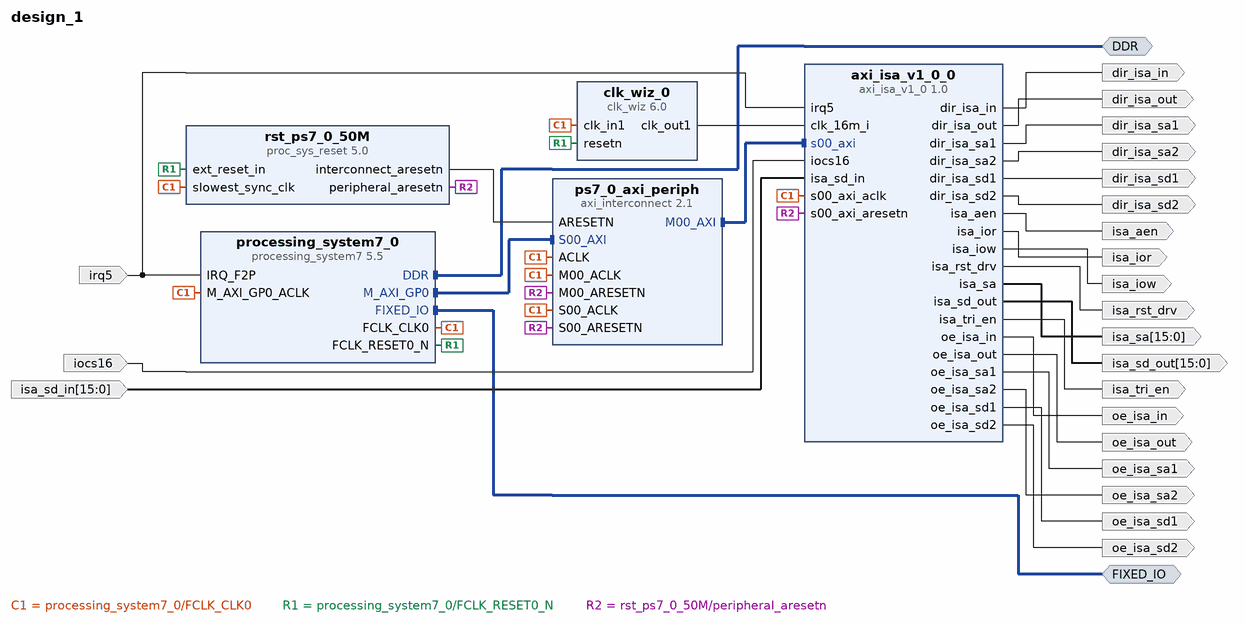
[diagram p0: block diagram of the top level]
# Vivado block design design_1, xc7z010clg400-1, Vivado 2018.2
create_bd_design design_1

create_bd_intf_port -mode Master -vlnv xilinx.com:interface:ddrx_rtl:1.0 DDR
create_bd_intf_port -mode Master -vlnv xilinx.com:display_processing_system7:fixedio_rtl:1.0 FIXED_IO
create_bd_port -dir O isa_tri_en
create_bd_port -dir O -from 15 -to 0 isa_sd_out
create_bd_port -dir O isa_aen
create_bd_port -dir O isa_rst_drv
create_bd_port -dir O isa_ior
create_bd_port -dir O isa_iow
create_bd_port -dir O -from 15 -to 0 isa_sa
create_bd_port -dir O dir_isa_out
create_bd_port -dir O dir_isa_in
create_bd_port -dir O dir_isa_sa2
create_bd_port -dir O dir_isa_sa1
create_bd_port -dir O dir_isa_sd2
create_bd_port -dir O dir_isa_sd1
create_bd_port -dir O oe_isa_out
create_bd_port -dir O oe_isa_in
create_bd_port -dir O oe_isa_sa2
create_bd_port -dir O oe_isa_sa1
create_bd_port -dir O oe_isa_sd2
create_bd_port -dir O oe_isa_sd1
create_bd_port -dir I iocs16
create_bd_port -dir I irq5
create_bd_port -dir I -from 15 -to 0 isa_sd_in

create_bd_cell -type ip -vlnv xilinx.com:ip:processing_system7:5.5 processing_system7_0
set_property -dict [list \
  CONFIG.PCW_SDIO_PERIPHERAL_FREQMHZ 100 \
  CONFIG.PCW_UART_PERIPHERAL_FREQMHZ 100 \
  CONFIG.PCW_USE_FABRIC_INTERRUPT 1 \
  CONFIG.PCW_IRQ_F2P_INTR 1 \
  CONFIG.PCW_PRESET_BANK1_VOLTAGE {LVCMOS 1.8V} \
  CONFIG.PCW_UIPARAM_DDR_PARTNO {MT41J128M16 HA-125} \
  CONFIG.PCW_QSPI_PERIPHERAL_ENABLE 1 \
  CONFIG.PCW_QSPI_QSPI_IO {MIO 1 .. 6} \
  CONFIG.PCW_QSPI_GRP_SINGLE_SS_ENABLE 1 \
  CONFIG.PCW_QSPI_GRP_SINGLE_SS_IO {MIO 1 .. 6} \
  CONFIG.PCW_SINGLE_QSPI_DATA_MODE x4 \
  CONFIG.PCW_ENET0_PERIPHERAL_ENABLE 1 \
  CONFIG.PCW_ENET0_ENET0_IO {MIO 16 .. 27} \
  CONFIG.PCW_ENET0_GRP_MDIO_ENABLE 1 \
  CONFIG.PCW_ENET0_GRP_MDIO_IO {MIO 52 .. 53} \
  CONFIG.PCW_SD0_PERIPHERAL_ENABLE 1 \
  CONFIG.PCW_SD0_SD0_IO {MIO 40 .. 45} \
  CONFIG.PCW_SD0_GRP_CD_ENABLE 1 \
  CONFIG.PCW_SD0_GRP_CD_IO {MIO 47} \
  CONFIG.PCW_SD0_GRP_WP_ENABLE 0 \
  CONFIG.PCW_UART1_PERIPHERAL_ENABLE 1 \
  CONFIG.PCW_UART1_UART1_IO {MIO 48 .. 49} \
] [get_bd_cells processing_system7_0]
# 130 more settings of processing_system7_0 are not shown: defaults, MIO pin electricals, DDR timing, and values the tool derives
create_bd_cell -type ip -vlnv xilinx.com:ip:clk_wiz:6.0 clk_wiz_0
set_property -dict [list \
  CONFIG.PRIM_IN_FREQ 50 \
  CONFIG.CLKIN1_JITTER_PS 200.0 \
  CONFIG.CLKOUT1_REQUESTED_OUT_FREQ 16 \
  CONFIG.USE_LOCKED false \
  CONFIG.RESET_PORT resetn \
  CONFIG.MMCM_DIVCLK_DIVIDE 1 \
  CONFIG.MMCM_CLKFBOUT_MULT_F 20.000 \
  CONFIG.MMCM_CLKIN1_PERIOD 20.000 \
  CONFIG.MMCM_CLKIN2_PERIOD 10.0 \
  CONFIG.MMCM_CLKOUT0_DIVIDE_F 62.500 \
  CONFIG.RESET_TYPE ACTIVE_LOW \
  CONFIG.CLKOUT1_JITTER 260.765 \
  CONFIG.CLKOUT1_PHASE_ERROR 164.985 \
] [get_bd_cells clk_wiz_0]
create_bd_cell -type ip -vlnv xilinx.com:ip:axi_interconnect:2.1 ps7_0_axi_periph
set_property -dict {CONFIG.NUM_MI 1} [get_bd_cells ps7_0_axi_periph]
create_bd_cell -type ip -vlnv xilinx.com:ip:proc_sys_reset:5.0 rst_ps7_0_50M
create_bd_cell -type ip -vlnv xilinx.com:user:axi_isa_v1_0:1.0 axi_isa_v1_0_0

# ---- connections ----

connect_bd_intf_net [get_bd_intf_pins processing_system7_0/M_AXI_GP0] [get_bd_intf_pins ps7_0_axi_periph/S00_AXI]
connect_bd_intf_net [get_bd_intf_pins ps7_0_axi_periph/M00_AXI] [get_bd_intf_pins axi_isa_v1_0_0/s00_axi]
connect_bd_intf_net [get_bd_intf_ports DDR] [get_bd_intf_pins processing_system7_0/DDR]
connect_bd_intf_net [get_bd_intf_ports FIXED_IO] [get_bd_intf_pins processing_system7_0/FIXED_IO]
connect_bd_net [get_bd_pins processing_system7_0/FCLK_CLK0] \
  [get_bd_pins clk_wiz_0/clk_in1] [get_bd_pins rst_ps7_0_50M/slowest_sync_clk] \
  [get_bd_pins processing_system7_0/M_AXI_GP0_ACLK] [get_bd_pins axi_isa_v1_0_0/s00_axi_aclk] \
  [get_bd_pins ps7_0_axi_periph/M00_ACLK] [get_bd_pins ps7_0_axi_periph/S00_ACLK] [get_bd_pins ps7_0_axi_periph/ACLK]
connect_bd_net [get_bd_pins processing_system7_0/FCLK_RESET0_N] [get_bd_pins rst_ps7_0_50M/ext_reset_in] [get_bd_pins clk_wiz_0/resetn]
connect_bd_net [get_bd_pins rst_ps7_0_50M/peripheral_aresetn] \
  [get_bd_pins axi_isa_v1_0_0/s00_axi_aresetn] [get_bd_pins ps7_0_axi_periph/M00_ARESETN] \
  [get_bd_pins ps7_0_axi_periph/S00_ARESETN]
connect_bd_net [get_bd_pins rst_ps7_0_50M/interconnect_aresetn] [get_bd_pins ps7_0_axi_periph/ARESETN]
connect_bd_net [get_bd_pins axi_isa_v1_0_0/isa_tri_en] [get_bd_ports isa_tri_en]
connect_bd_net [get_bd_pins axi_isa_v1_0_0/isa_sd_out] [get_bd_ports isa_sd_out]
connect_bd_net [get_bd_pins axi_isa_v1_0_0/isa_aen] [get_bd_ports isa_aen]
connect_bd_net [get_bd_pins axi_isa_v1_0_0/isa_rst_drv] [get_bd_ports isa_rst_drv]
connect_bd_net [get_bd_pins axi_isa_v1_0_0/isa_ior] [get_bd_ports isa_ior]
connect_bd_net [get_bd_pins axi_isa_v1_0_0/isa_iow] [get_bd_ports isa_iow]
connect_bd_net [get_bd_pins axi_isa_v1_0_0/isa_sa] [get_bd_ports isa_sa]
connect_bd_net [get_bd_pins axi_isa_v1_0_0/dir_isa_out] [get_bd_ports dir_isa_out]
connect_bd_net [get_bd_pins axi_isa_v1_0_0/dir_isa_in] [get_bd_ports dir_isa_in]
connect_bd_net [get_bd_pins axi_isa_v1_0_0/dir_isa_sa2] [get_bd_ports dir_isa_sa2]
connect_bd_net [get_bd_pins axi_isa_v1_0_0/dir_isa_sa1] [get_bd_ports dir_isa_sa1]
connect_bd_net [get_bd_pins axi_isa_v1_0_0/dir_isa_sd2] [get_bd_ports dir_isa_sd2]
connect_bd_net [get_bd_pins axi_isa_v1_0_0/dir_isa_sd1] [get_bd_ports dir_isa_sd1]
connect_bd_net [get_bd_pins axi_isa_v1_0_0/oe_isa_out] [get_bd_ports oe_isa_out]
connect_bd_net [get_bd_pins axi_isa_v1_0_0/oe_isa_in] [get_bd_ports oe_isa_in]
connect_bd_net [get_bd_pins axi_isa_v1_0_0/oe_isa_sa2] [get_bd_ports oe_isa_sa2]
connect_bd_net [get_bd_pins axi_isa_v1_0_0/oe_isa_sa1] [get_bd_ports oe_isa_sa1]
connect_bd_net [get_bd_pins axi_isa_v1_0_0/oe_isa_sd2] [get_bd_ports oe_isa_sd2]
connect_bd_net [get_bd_pins axi_isa_v1_0_0/oe_isa_sd1] [get_bd_ports oe_isa_sd1]
connect_bd_net [get_bd_pins clk_wiz_0/clk_out1] [get_bd_pins axi_isa_v1_0_0/clk_16m_i]
connect_bd_net -net iocs16_0_1 [get_bd_ports iocs16] [get_bd_pins axi_isa_v1_0_0/iocs16]
connect_bd_net -net irq5_0_1 [get_bd_ports irq5] [get_bd_pins axi_isa_v1_0_0/irq5] [get_bd_pins processing_system7_0/IRQ_F2P]
connect_bd_net -net isa_sd_in_0_1 [get_bd_ports isa_sd_in] [get_bd_pins axi_isa_v1_0_0/isa_sd_in]

# ---- address map ----
assign_bd_address -offset 0x43C00000 -range 64K -target_address_space [get_bd_addr_spaces processing_system7_0/Data] [get_bd_addr_segs axi_isa_v1_0_0/s00_axi/reg0]

validate_bd_design
save_bd_design
